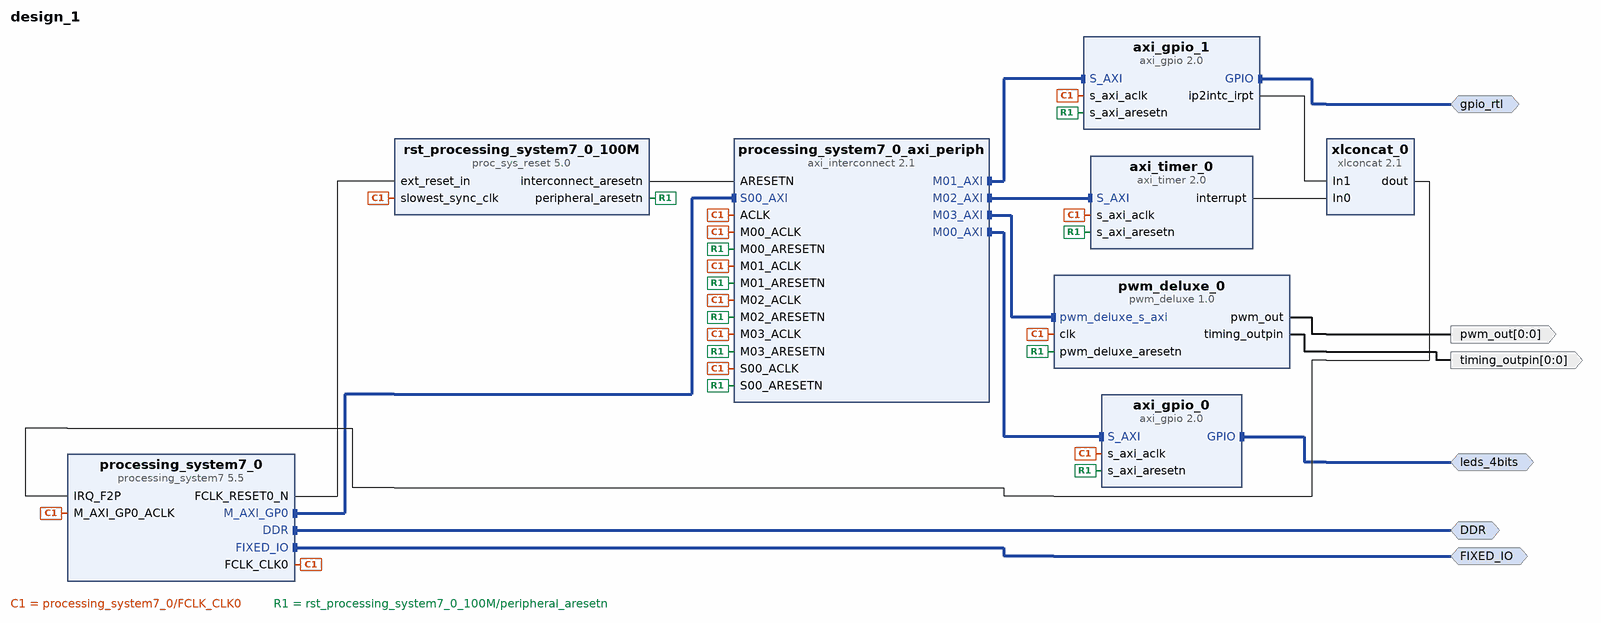
[diagram p0: block diagram of the top level]
# Vivado block design design_1, Vivado 2015.4
create_bd_design design_1

create_bd_intf_port -mode Master -vlnv xilinx.com:interface:ddrx_rtl:1.0 DDR
create_bd_intf_port -mode Master -vlnv xilinx.com:display_processing_system7:fixedio_rtl:1.0 FIXED_IO
create_bd_intf_port -mode Master -vlnv xilinx.com:interface:gpio_rtl:1.0 leds_4bits
create_bd_intf_port -mode Master -vlnv xilinx.com:interface:gpio_rtl:1.0 gpio_rtl
create_bd_port -dir O -from 0 -to 0 -type data pwm_out
create_bd_port -dir O -from 0 -to 0 -type data timing_outpin

create_bd_cell -type ip -vlnv xilinx.com:ip:processing_system7:5.5 processing_system7_0
set_property -dict [list \
  CONFIG.PCW_UIPARAM_DDR_FREQ_MHZ 525 \
  CONFIG.PCW_CRYSTAL_PERIPHERAL_FREQMHZ 50.000000 \
  CONFIG.PCW_APU_PERIPHERAL_FREQMHZ 650 \
  CONFIG.PCW_SDIO_PERIPHERAL_FREQMHZ 50 \
  CONFIG.PCW_FPGA0_PERIPHERAL_FREQMHZ 100 \
  CONFIG.PCW_USE_FABRIC_INTERRUPT 1 \
  CONFIG.PCW_IRQ_F2P_INTR 1 \
  CONFIG.PCW_PRESET_BANK1_VOLTAGE {LVCMOS 1.8V} \
  CONFIG.PCW_UIPARAM_DDR_PARTNO {MT41K128M16 JT-125} \
  CONFIG.PCW_QSPI_PERIPHERAL_ENABLE 1 \
  CONFIG.PCW_QSPI_GRP_SINGLE_SS_ENABLE 1 \
  CONFIG.PCW_QSPI_GRP_FBCLK_ENABLE 1 \
  CONFIG.PCW_ENET0_PERIPHERAL_ENABLE 1 \
  CONFIG.PCW_ENET0_ENET0_IO {MIO 16 .. 27} \
  CONFIG.PCW_ENET0_GRP_MDIO_ENABLE 1 \
  CONFIG.PCW_ENET0_RESET_ENABLE 0 \
  CONFIG.PCW_SD0_PERIPHERAL_ENABLE 1 \
  CONFIG.PCW_SD0_GRP_CD_ENABLE 1 \
  CONFIG.PCW_SD0_GRP_CD_IO {MIO 47} \
  CONFIG.PCW_SD0_GRP_WP_ENABLE 1 \
  CONFIG.PCW_UART1_PERIPHERAL_ENABLE 1 \
  CONFIG.PCW_TTC0_PERIPHERAL_ENABLE 1 \
  CONFIG.PCW_USB0_PERIPHERAL_ENABLE 1 \
  CONFIG.PCW_USB0_RESET_ENABLE 1 \
  CONFIG.PCW_USB0_RESET_IO {MIO 46} \
  CONFIG.PCW_GPIO_MIO_GPIO_ENABLE 1 \
] [get_bd_cells processing_system7_0]
# 105 more settings of processing_system7_0 are not shown: defaults, MIO pin electricals, DDR timing, and values the tool derives
create_bd_cell -type ip -vlnv xilinx.com:ip:axi_gpio:2.0 axi_gpio_0
set_property -dict {CONFIG.USE_BOARD_FLOW true CONFIG.GPIO_BOARD_INTERFACE leds_4bits} [get_bd_cells axi_gpio_0]
create_bd_cell -type ip -vlnv xilinx.com:ip:axi_interconnect:2.1 processing_system7_0_axi_periph
set_property -dict {CONFIG.NUM_MI 4} [get_bd_cells processing_system7_0_axi_periph]
create_bd_cell -type ip -vlnv xilinx.com:ip:proc_sys_reset:5.0 rst_processing_system7_0_100M
create_bd_cell -type ip -vlnv xilinx.com:ip:axi_gpio:2.0 axi_gpio_1
set_property -dict [list \
  CONFIG.C_GPIO_WIDTH 2 \
  CONFIG.C_INTERRUPT_PRESENT 1 \
  CONFIG.USE_BOARD_FLOW true \
  CONFIG.GPIO_BOARD_INTERFACE Custom \
] [get_bd_cells axi_gpio_1]
create_bd_cell -type ip -vlnv xilinx.com:ip:axi_timer:2.0 axi_timer_0
create_bd_cell -type ip -vlnv xilinx.com:ip:xlconcat:2.1 xlconcat_0
create_bd_cell -type ip -vlnv User_Company:SysGen:pwm_deluxe:1.0 pwm_deluxe_0

# ---- connections ----

connect_bd_intf_net [get_bd_intf_pins processing_system7_0/M_AXI_GP0] [get_bd_intf_pins processing_system7_0_axi_periph/S00_AXI]
connect_bd_intf_net [get_bd_intf_pins processing_system7_0_axi_periph/M00_AXI] [get_bd_intf_pins axi_gpio_0/S_AXI]
connect_bd_intf_net [get_bd_intf_pins processing_system7_0_axi_periph/M01_AXI] [get_bd_intf_pins axi_gpio_1/S_AXI]
connect_bd_intf_net [get_bd_intf_pins processing_system7_0_axi_periph/M02_AXI] [get_bd_intf_pins axi_timer_0/S_AXI]
connect_bd_intf_net [get_bd_intf_pins processing_system7_0_axi_periph/M03_AXI] [get_bd_intf_pins pwm_deluxe_0/pwm_deluxe_s_axi]
connect_bd_intf_net [get_bd_intf_ports DDR] [get_bd_intf_pins processing_system7_0/DDR]
connect_bd_intf_net [get_bd_intf_ports FIXED_IO] [get_bd_intf_pins processing_system7_0/FIXED_IO]
connect_bd_intf_net [get_bd_intf_ports leds_4bits] [get_bd_intf_pins axi_gpio_0/GPIO]
connect_bd_intf_net [get_bd_intf_ports gpio_rtl] [get_bd_intf_pins axi_gpio_1/GPIO]
connect_bd_net [get_bd_pins processing_system7_0/FCLK_CLK0] \
  [get_bd_pins processing_system7_0/M_AXI_GP0_ACLK] [get_bd_pins processing_system7_0_axi_periph/S00_ACLK] \
  [get_bd_pins rst_processing_system7_0_100M/slowest_sync_clk] [get_bd_pins processing_system7_0_axi_periph/ACLK] \
  [get_bd_pins axi_gpio_0/s_axi_aclk] [get_bd_pins processing_system7_0_axi_periph/M00_ACLK] \
  [get_bd_pins axi_gpio_1/s_axi_aclk] [get_bd_pins processing_system7_0_axi_periph/M01_ACLK] \
  [get_bd_pins axi_timer_0/s_axi_aclk] [get_bd_pins processing_system7_0_axi_periph/M02_ACLK] [get_bd_pins pwm_deluxe_0/clk] \
  [get_bd_pins processing_system7_0_axi_periph/M03_ACLK]
connect_bd_net [get_bd_pins processing_system7_0/FCLK_RESET0_N] [get_bd_pins rst_processing_system7_0_100M/ext_reset_in]
connect_bd_net [get_bd_pins rst_processing_system7_0_100M/peripheral_aresetn] \
  [get_bd_pins processing_system7_0_axi_periph/S00_ARESETN] [get_bd_pins axi_gpio_0/s_axi_aresetn] \
  [get_bd_pins processing_system7_0_axi_periph/M00_ARESETN] [get_bd_pins axi_gpio_1/s_axi_aresetn] \
  [get_bd_pins processing_system7_0_axi_periph/M01_ARESETN] [get_bd_pins axi_timer_0/s_axi_aresetn] \
  [get_bd_pins processing_system7_0_axi_periph/M02_ARESETN] [get_bd_pins pwm_deluxe_0/pwm_deluxe_aresetn] \
  [get_bd_pins processing_system7_0_axi_periph/M03_ARESETN]
connect_bd_net [get_bd_pins rst_processing_system7_0_100M/interconnect_aresetn] [get_bd_pins processing_system7_0_axi_periph/ARESETN]
connect_bd_net [get_bd_pins axi_timer_0/interrupt] [get_bd_pins xlconcat_0/In0]
connect_bd_net [get_bd_pins axi_gpio_1/ip2intc_irpt] [get_bd_pins xlconcat_0/In1]
connect_bd_net [get_bd_pins xlconcat_0/dout] [get_bd_pins processing_system7_0/IRQ_F2P]
connect_bd_net [get_bd_pins pwm_deluxe_0/pwm_out] [get_bd_ports pwm_out]
connect_bd_net [get_bd_pins pwm_deluxe_0/timing_outpin] [get_bd_ports timing_outpin]

# ---- address map ----
assign_bd_address -offset 0x41200000 -range 64K -target_address_space [get_bd_addr_spaces processing_system7_0/Data] [get_bd_addr_segs axi_gpio_0/S_AXI/Reg]
assign_bd_address -offset 0x41210000 -range 64K -target_address_space [get_bd_addr_spaces processing_system7_0/Data] [get_bd_addr_segs axi_gpio_1/S_AXI/Reg]
assign_bd_address -offset 0x42800000 -range 64K -target_address_space [get_bd_addr_spaces processing_system7_0/Data] [get_bd_addr_segs axi_timer_0/S_AXI/Reg]
assign_bd_address -offset 0x43C00000 -range 64K -target_address_space [get_bd_addr_spaces processing_system7_0/Data] [get_bd_addr_segs pwm_deluxe_0/pwm_deluxe_s_axi/reg0]

validate_bd_design
save_bd_design
